# Altium schematic sheet bms_GAUGE_R00.SchDoc: Gauge
size A4; Author: Tobias Bavasso Piizzi; CompanyName: Introducción al Diseño de Circuitos Impresos; Organization: UTN FRBA; Revision: R00
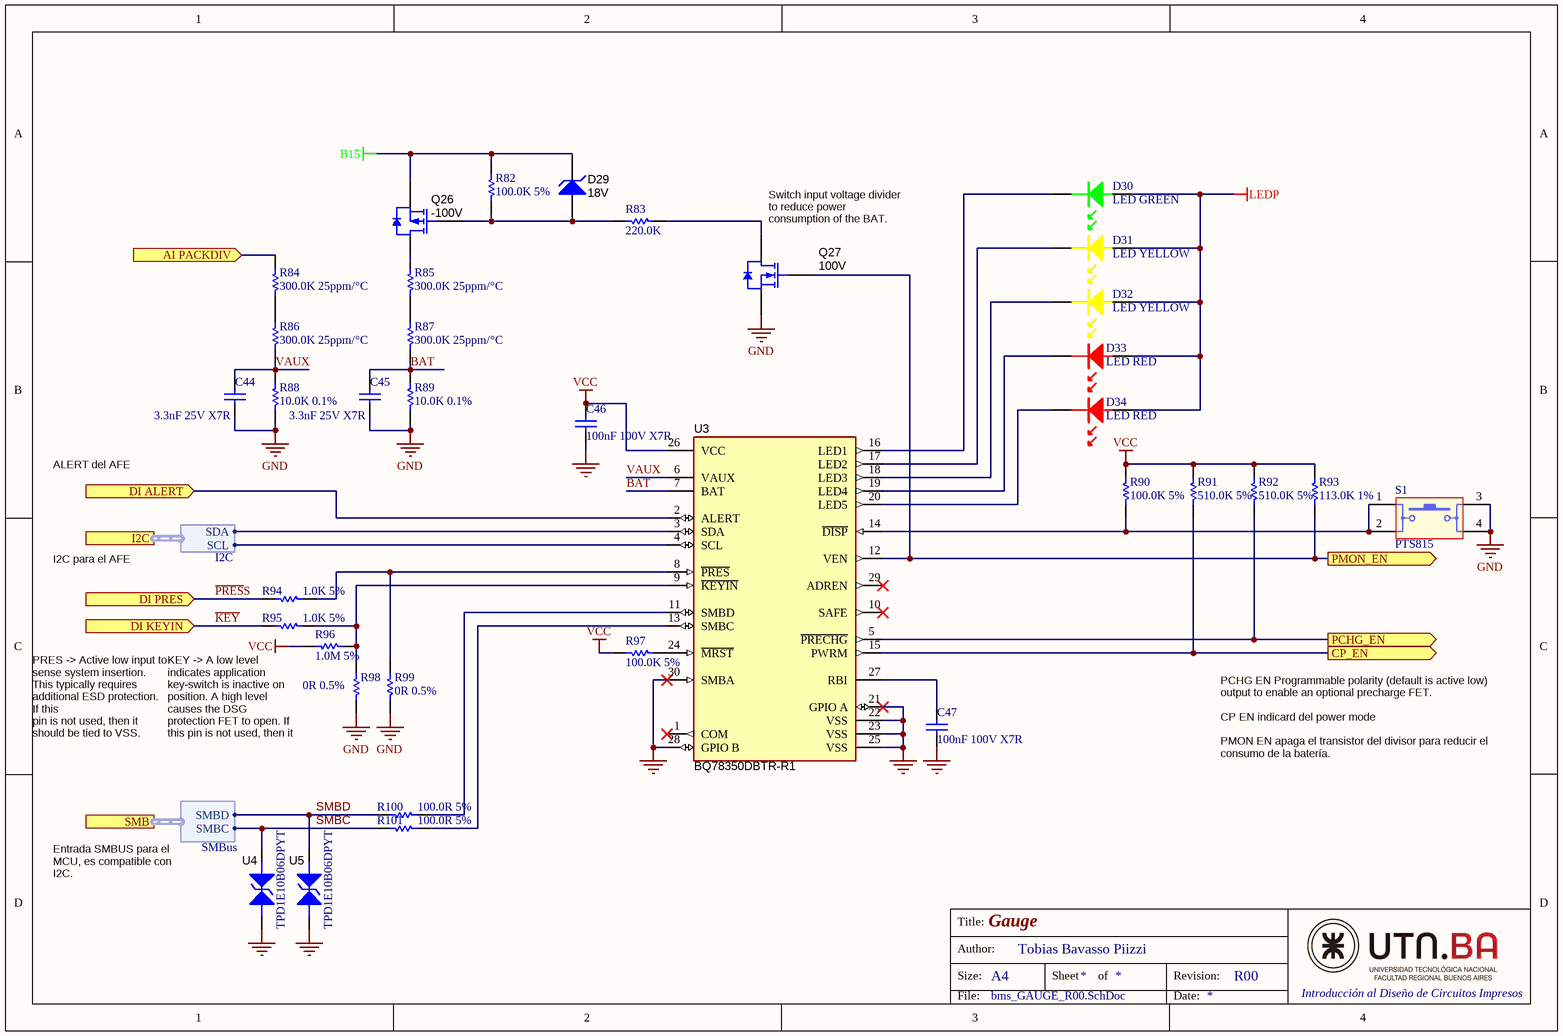
[diagram p0: bms_GAUGE_R00.SchDoc]

## Parts
C44  3.3nF 25V X7R  [C0603]
C45  3.3nF 25V X7R  [C0603]
C46  100nF 100V X7R  [C0603]
C47  100nF 100V X7R  [C0603]
D29  value 18V  [sod-323]  (hidden comment: MMSZ5248BS-7-F)
D30  LED GREEN  [LED0603-G]
D31  LED YELLOW  [LED0603-Y]
D32  LED YELLOW  [LED0603-Y]
D33  LED RED  [LED0603-R]
D34  LED RED  [LED0603-R]
Q26  value -100V  [SOT-23]  (hidden comment: ZXMP10A13FTA)
Q27  value 100V  [SOT-23]  (hidden comment: BSS123)
R82  100.0K 5%  [R0603]
R83  220.0K  [R0603]
R84  300.0K 25ppm/°C  [R0603]
R85  300.0K 25ppm/°C  [R0603]
R86  300.0K 25ppm/°C  [R0603]
R87  300.0K 25ppm/°C  [R0603]
R88  10.0K 0.1%  [R0603]
R89  10.0K 0.1%  [R0603]
R90  100.0K 5%  [R0603]
R91  510.0K 5%  [R0603]
R92  510.0K 5%  [R0603]
R93  113.0K 1%  [R0603]
R94  1.0K 5%  [R0603]
R95  1.0K 5%  [R0603]
R96  1.0M 5%  [R0603]
R97  100.0K 5%  [R0603]
R98  0R 0.5%  [R0603]
R99  0R 0.5%  [R0603]
R100  100.0R 5%  [R0603]
R101  100.0R 5%  [R0603]
S1  PTS815  [PTS815SJK250SMTRLFS]
U3  BQ78350DBTR-R1  [DBT0030A_N]
U4  TPD1E10B06DPYT  [DPY0002A]
U5  TPD1E10B06DPYT  [DPY0002A]

## Ports
AI PACKDIV (in), CP_EN (out), DI ALERT (in), DI KEYIN (in), DI PRES (in), I2C (harness I2C), PCHG_EN (out), PMON_EN (out), SMB (harness SMBus)

## Harnesses
I2C: SDA, SCL
SMBus: SMBD, SMBC

## Nets
B15: D29.1(K) Q26.2(S) R82.1
GND: C44.1 C45.1 C46.1 C47.1 Q27.2(S) R88.2 R89.2 R98.2 R99.2 S1.3 S1.4 U3.21(GPIO_A) U3.22(VSS) U3.23(VSS) U3.25(VSS) U3.28(GPIO_B) U3.30(SMBA) U4.1(IO_LINE) U5.1(IO_LINE)
LEDP: D30.2(A) D31.2(A) D32.2(A) D33.2(A) D34.2(A)
VCC: C46.2 R90.2 R91.1 R92.1 R93.1 R96.1 R97.2 U3.26(VCC)
~{KEY}: R95.2 ; port DI KEYIN
~{PRES}S: R94.2 ; port DI PRES
AI PACKDIV: R84.1 ; port AI PACKDIV
BAT: C45.2 R87.2 R89.1 U3.7(BAT)
CP_EN: R91.2 U3.15(PWRM) ; port CP_EN
DI ALERT: U3.2(ALERT) ; port DI ALERT
PCHG_EN: R92.2 U3.5(~{PRECHG}) ; port PCHG_EN
PMON_EN: Q27.1(G) R93.2 U3.12(VEN) ; port PMON_EN
SMBC: R101.2 U4.2(GND) ; port SMB.SMBC
SMBD: R100.2 U5.2(GND) ; port SMB.SMBD
VAUX: C44.2 R86.2 R88.1 U3.6(VAUX)
NetC47_2: C47.2 U3.27(RBI)
NetD29_2: D29.2(A) Q26.1(G) R82.2 R83.2
NetD30_1: D30.1(K) U3.16(LED1)
NetD31_1: D31.1(K) U3.17(LED2)
NetD32_1: D32.1(K) U3.18(LED3)
NetD33_1: D33.1(K) U3.19(LED4)
NetD34_1: D34.1(K) U3.20(LED5)
NetQ26_3: Q26.3(D) R85.1
NetQ27_3: Q27.3(D) R83.1
NetR84_2: R84.2 R86.1
NetR85_2: R85.2 R87.1
NetR90_1: R90.1 S1.1 S1.2 U3.14(~{DISP})
NetR94_1: R94.1 R99.1 U3.8(~{PRES})
NetR95_1: R95.1 R96.2 R98.1 U3.9(~{KEYIN})
NetR97_1: R97.1 U3.24(~{MRST})
NetR100_1: R100.1 U3.11(SMBD)
NetR101_1: R101.1 U3.13(SMBC)
NetU3_3: U3.3(SDA) ; port I2C.SDA
NetU3_4: U3.4(SCL) ; port I2C.SCL

Not connected (* = marked no-connect by the designer): U3 1(COM)* 10(SAFE)* 29(ADREN)*

## Notes on the sheet
- (near Q27) Switch input voltage divider to reduce power consumption of the BAT.
- ALERT del AFE
- I2C para el AFE
- PRES -> Active low input to sense system insertion. This typically requires additional ESD protection. If this
  pin is not used, then it should be tied to VSS.
- (near R96) KEY -> A low level indicates application key-switch is inactive on position. A high level causes the DSG
  protection FET to open. If this pin is not used, then it should be tied to VSS.
- PCHG EN Programmable polarity (default is active low) output to enable an optional precharge FET.
  CP EN indicard del power mode
  PMON EN apaga el transistor del divisor para reducir el consumo de la batería.
- Entrada SMBUS para el MCU, es compatible con I2C.
- Title:
- Size:
- Author:
- A4
- Sheet
- of
- Revision:
- File:
- Date:

## Library data of the parts
C44-C47 = Cap 0603: Capacitor
D29 = MMSZ5248BS-7-F: Diode, Zener, 18 V, 200 mW, SOD-323; Manufacturer: Diodes Inc.; SymbolCreator: a0412235; U/M: EA; Power_W: 0.2; Vz_V: 18; Value1: 0.2W; RJA_CperW: 350; AEC Category: Q101; SymbolVersion: 2010-08-25; PartNumber: MMSZ5248BS-7-F; PackageReference: SOD-323; CompType: Zener; Vr_V: N/A; MountType: SMT; RoHS: Y; ComponentLink1Description: Datasheet link; ComponentLink1URL: http://www.diodes.com/datasheets/ds31038.pdf; Published: 2008-10-08; Publisher: Texas Instruments; LatestRevisionDate: 2016-01-12; LatestRevisionNote: Updated Supplier Data; Supplier 1: Digi-Key; Supplier Part Number 1: MMSZ5248BS-FDICT-ND; Supplier 2: Mouser; Supplier Part Number 2: 621-MMSZ5248BS-F; Supplier 3: Farnell; Supplier Part Number 3: 1858632; AEC Qualified: ?
D30 = LED GREEN: LED G
D31 D32 = LED YELLOW: LED Y
D33 D34 = LED RED: LED R
Q26 = ZXMP10A13FTA: MOSFET, P-CH, -100V, -0.6A, SOT-23; Manufacturer: Diodes Inc.; Alternate Manufacturer: None; U/M: EA; ChType: P; VdsMax_V: -100; Value1: 1 ohm; Rdson45_Ohm: 1; Value2: 3.5 nC; QgTyp_nC: 3.5; Vgs_V: -4; IdsMax_A: -0.6; SymbolVersion: 2008-07-09; PartNumber: ZXMP10A13FTA; PackageReference: SOT-23; CompType: MOSFET; RoHS: Y; MountType: SMT; Published: 2008-06-19; Publisher: Texas Instruments; LatestRevisionDate: 2013-12-01; LatestRevisionNote: Added parts.; ComponentLink1Description: Datasheet link; ComponentLink1URL: http://www.diodes.com/datasheets/ZXMP10A13F.pdf; Supplier 1: Digi-Key; Supplier Part Number 1: ZXMP10A13FCT-ND; Supplier 2: Mouser; Supplier Part Number 2: 522-ZXMP10A13FTA; Supplier 3: Farnell; Supplier Part Number 3: 1843777
Q27 = BSS123: MOSFET, N-CH, 100V, 0.17A, SOT-23; Manufacturer: Fairchild Semiconductor; Alternate Manufacturer: None; U/M: EA; ChType: N; VdsMax_V: 100; Value1: 10 ohm; Rdson45_Ohm: 10; Value2: 1.8 nC; QgTyp_nC: 1.8; Vgs_V: 20; IdsMax_A: 0.17; SymbolVersion: 2008-07-28; CompType: MOSFET; PartNumber: BSS123; PackageReference: SOT-23; RoHS: Y; MountType: SMT; Published: 2008-06-19; Publisher: Texas Instruments; LatestRevisionDate: 2013-10-21; LatestRevisionNote: Added parts.; ComponentLink1Description: Datasheet link; ComponentLink1URL: http://www.fairchildsemi.com/ds/BS/BSS123.pdf; Supplier 1: Digi-Key; Supplier Part Number 1: BSS123NCT-ND; Supplier 2: Mouser; Supplier Part Number 2: 512-BSS123; Supplier 3: Farnell; Supplier Part Number 3: 9845321
R82-R101 = Res: Resistor
S1 = PTS815: SWITCH TACTILE SPST-NO 0.05A 12V
U3 = BQ78350DBTR-R1: CEDV Li-Ion Gas Gauge and Battery Management Controller Companion to the bq769x0 Battery Monitoring AFE, DBT0030A; Alternate PartNumber: BQ78350DBT-R1; Manufacturer: Texas Instruments; SymbolCreator: x0208325; CompType: IC; U/M: EA; SymbolVersion: 2013-11-18; PartNumber: BQ78350DBTR-R1; PackageReference: DBT0030A; MountType: SMT; ComponentLink1Description: Datasheet Link; ComponentLink1URL: http://www.ti.com/lit/ds/symlink/bq78350-r1.pdf; RoHS: Y; Publisher: Texas Instruments; LatestRevisionDate: 2016-04-08; Alternate Manufacturer: Texas Instruments
U4 U5 = TPD1E10B06DPYT: ESD Protection in 0402 Package with 10 pF Capacitance and 6 V Breakdown, 1 Channel, -40 to +125 degC, 2-pin X2SON (DPY); Manufacturer: Texas Instruments; Alternate PartNumber: Equivalent; Breakdown Voltage(Min)(V): 6; Eco-Plan: TBD; IEC 61000-4-2 Air-Gap(+/- kV): 30; IO Capacitance(Typ)(pF): 10; SubFamily: ESD Solution; DatasheetVersion: SLLSEB1; PackageVersion: revA, Apr-2010; PackageReference: DPY0002A; PackageDescription: 2-Pin Plastic Small Outline No-Lead 1.0 x 0.6 x 0.4 mm Body; Supplier 1: Mouser; Supplier Part Number 1: N/A; IEC 61000-4-2 Contact(+/- kV): 30; IO Leakage Current(nA): 10; MountType: SMT; PartNumber: TPD1E10B06DPYT; ComponentLink1Description: Datasheet; ComponentLink1URL: http://www.ti.com/general/docs/lit/getliterature.tsp?genericPartNumber=TPD1E10B06&fileType=pdf; ComponentLink2Description: URL Link1; ComponentLink2URL: SamplesURL:http://www.ti.com/product/tpd1e10b06#samples; Alternate Manufacturer: Texas Instruments